# EAGLE design VibrationLights (EAGLE 8.5.0)
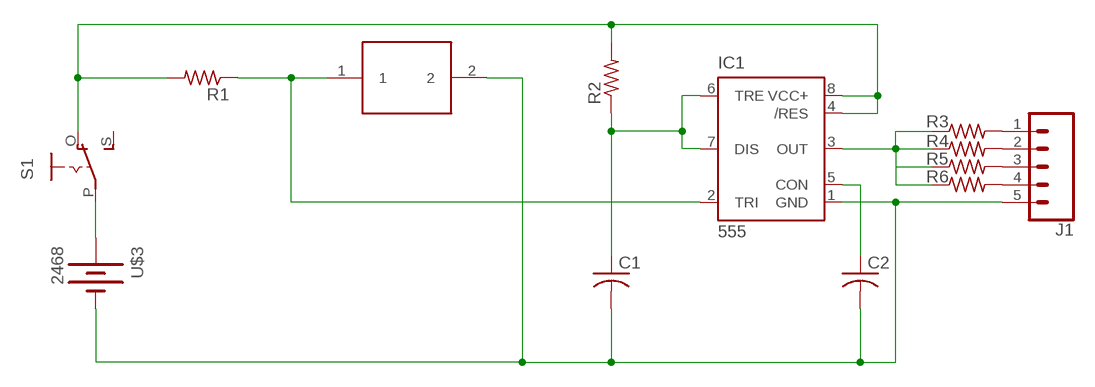
[diagram p0: schematic, sheet 1]

## Parts
C1  C-US050-045X075  [C050-045X075]
C2  C-US025-050X050  [C025-050X050]
IC1  555  555P  [DIP08]
J1  CONN_05PTH_LONGPADS  [1X05_LONGPADS]
R1  R-US_0204/5  [0204/5]
R2  R-US_0204/5  [0204/5]
R3  R-US_0204/5  [0204/5]
R4  R-US_0204/5  [0204/5]
R5  R-US_0204/5  [0204/5]
R6  R-US_0204/5  [0204/5]
S1  EG1218S  [EG1218]
U$1  SW-18010P  [SW-18010P]
U$3  2468  [2468]

## Nets
GND: C1.2 C2.2 IC1.1(GND) J1.5 U$1.2 U$3.NEG(-)
N$1: C1.1 IC1.6(TRE) IC1.7(DIS) R2.1
N$2: J1.1 R3.2
N$3: IC1.2(TRI) R1.1 U$1.1
N$4: J1.2 R4.2
N$5: C2.1 IC1.5(CON)
N$6: J1.3 R5.2
N$7: J1.4 R6.2
N$8: IC1.3(OUT) R3.1 R4.1 R5.1 R6.1
N$9: S1.P U$3.POS(+)
VCC: IC1.4(/RES) IC1.8(VCC+) R1.2 R2.2 S1.O
Unconnected: S1.S

## Library data of the parts
C1 C2 = rcl:C-US: CAPACITOR, American symbol; SPICEPREFIX: C
IC1 = SparkFun-IC-Special-Function:555: General purpose bipolar Timer Datasheet <http://www.sparkfun.com/datasheets/Components/General/ne555.pdf> SparkFun Products SparkFun SparkPunk Sequencer Kit <https://www.sparkfun.com/products/12707> (KIT-12707) Storefront Component: 555 Timer <https://www.sparkfun.com/products/9273> (COM-09273) Two parts valid for production: VFP: IC-11930 (M7555 PTH) VFP: IC-09173 (555 PTH) - Preferred; PROD_ID: IC-09173; PROD_ID_ALT: IC-09173
J1 = SparkFun-Connectors:CONN_05: Multi connection point. Often used as Generic Header-pin footprint for 0.1 inch spaced/style header connections On any of the 0.1 inch spaced packages, you can populate with these: Break Away Headers - Straight <https://www.sparkfun.com/products/116> (PRT-00116) Break Away Male Headers - Right Angle <https://www.sparkfun.com/products/553> (PRT-00553) Female Headers <https://www.sparkfun.com/products/115> (PRT-00115) Break Away Headers - Machine Pin <https://www.sparkfun.com/products/117> (PRT-00117) Break Away Female Headers - Swiss Machine Pin <https://www.sparkfun.com/products/743> (PRT-00743) For SCREWTERMINALS and SPRING TERMINALS visit here: Screw Terimnals on SparkFun.com <https://www.sparkfun.com/search/results?term=Screw+Terminals> (5mm/3.5mm/2.54mm spacing) This device is also useful as a general connection point to wire up your design to another part of your project. Our various solder wires solder well into these plated through hole pads. Hook-Up Wire - Assortment (Stranded, 22 AWG) <https://www.sparkfun.com/products/11375> (PRT-11375) Hook-Up Wire - Assortment (Solid Core, 22 AWG) <https://www.sparkfun.com/products/11367> (PRT-11367) View the entire wire category on our website here <https://www.sparkfun.com/categories/141> Special notes: Molex polarized connector foot print use with SKU : PRT-08231 with associated crimp pins and housings. 1MM SMD Version SKU: PRT-10208
R1-R6 = resistor:R-US_: RESISTOR, American symbol
S1 = adafruit:EG1218: SLIDING SWITCH 0.1" spacing through hole, vertical SPDT slide switch http://www.ladyada.net/library/pcb/eaglelibrary.html
U$1 = jgennari:SW-18010P
U$3 = jgennari:2468

## Board
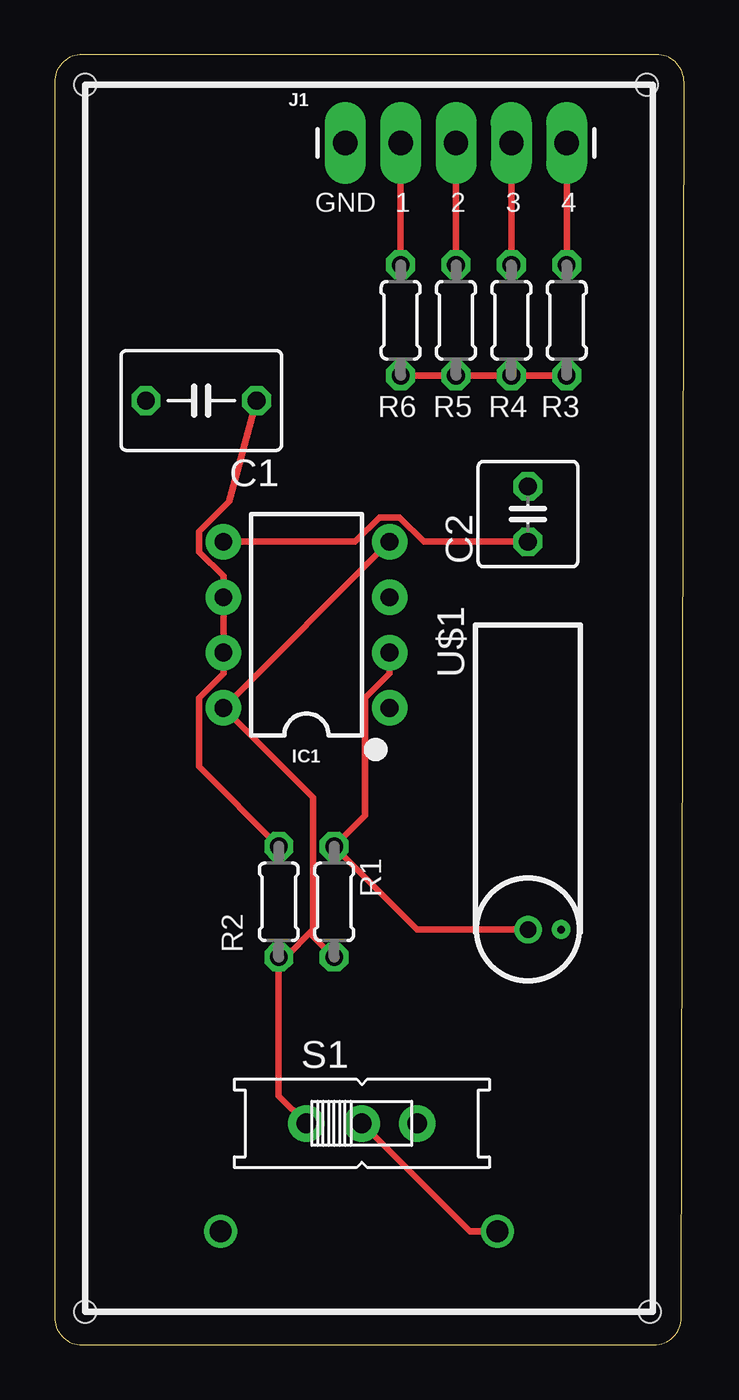
[diagram p1: board, top side]
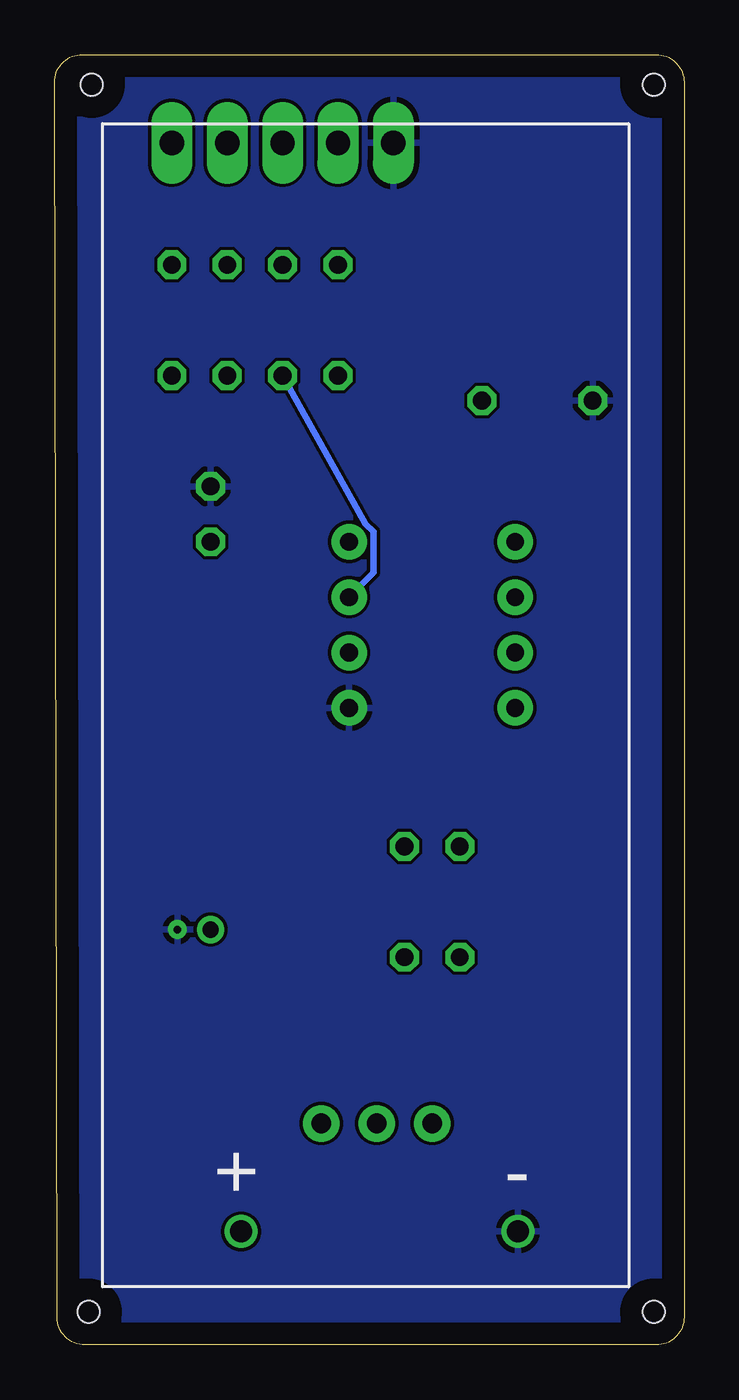
[diagram p2: board, bottom side, seen from below]

Size 28.88 x 59.17 mm. Coordinates in mm from the lower left corner, seen from the top.
Outline: 0,57.9 0,1.27 arc90 1.27,0 27.49,0 arc90 28.76,1.27 28.88,57.9 arc90 27.61,59.17 1.27,59.17 arc90 0,57.9
Copper layers (1*16): Top 0.035mm / dielectric 1.5mm / Bottom 0.035mm
Design rules "default": minimum track width 6mil, minimum drill 0.35mm, track to track 6mil, track to pad 6mil, pad to pad 6mil, via to via 6mil, smd to smd 6mil, copper to edge 40mil, drill to drill 6mil, minimum pad ring 10mil, minimum via ring 8mil, stop-mask expansion 4mil, vias tented up to drill 0mil, thermal gap 10mil
Holes 1 mm at 1.4,1.52 27.3,1.52 27.18,57.78 1.4,57.78

### Footprints (pad centres in the part's own frame; a part is rotated, then mirrored left to right if it is on the bottom)
C050-045X075 = drill 0.813 octagon: 1 -2.54,0; 2 2.54,0
C025-050X050 = drill 0.813 octagon: 1 -1.27,0; 2 1.27,0
DIP08 = drill 0.813 pad 1.626: 1 -3.81,-3.81; 2 -1.27,-3.81; 3 1.27,-3.81; 4 3.81,-3.81; 5 3.81,3.81; 6 1.27,3.81; 7 -1.27,3.81; 8 -3.81,3.81
1X05_LONGPADS = drill 1.118 pad 1.88 long: 1 0,0; 2 2.54,0; 3 5.08,0; 4 7.62,0; 5 10.16,0
0204/5 = drill 0.813 octagon: 1 -2.54,0; 2 2.54,0
EG1218 = drill 0.9 pad 1.676: O -2.54,0; P 0,0; S 2.54,0
SW-18010P = drill 0.75: 1 0,0 | drill 0.35: 2 1.524,0
2468 = drill 1: NEG 50.8,19.05; POS 50.8,6.35

### Placement (x,y rotation side)
C1  6.73,43.31 180 top
C2  21.72,38.1 90 top
IC1  11.56,33.02 90 top
J1  23.5,55.12 180 top
R1  12.83,20.32 270 top
R2  10.29,20.32 270 top
R3  23.5,46.99 90 top
R4  20.95,46.99 90 top
R5  18.41,46.99 90 top
R6  15.88,46.99 90 top
S1  14.1,10.16 0 top
U$1  21.72,19.05 0 top
U$3  26.67,56.01 270 bottom

### Tracks (layer width: path | path; a pad name or v marks a point on that pad's centre or on a via)
GND
  pour Bottom: -2.41,67.31 30.61,67.31 30.61,-2.54 -2.41,-2.54
N$1
  Top 0.305: R2.1 6.63,26.52 6.63,29.67 7.75,30.79 IC1.7 IC1.6 7.75,35.25 6.63,36.37 6.63,37.29 8,38.66 C1.1
N$2
  Top 0.305: J1.1 R3.2
N$3
  Top 0.305: U$1.1 16.64,19.05 R1.1 14.25,24.28 14.25,29.67 15.37,30.79 IC1.2
N$4
  Top 0.305: J1.2 R4.2
N$5
  Top 0.305: IC1.5 13.79,36.83 14.9,37.95 15.83,37.95 16.95,36.83 C2.1
N$6
  Top 0.305: R5.2 J1.3
N$7
  Top 0.305: R6.2 J1.4
N$8
  Top 0.305: R3.1 R4.1 R5.1 R6.1
  Bottom 0.305: R5.1 14.6,37.65 14.25,37.29 14.25,35.41 IC1.3
N$9
  Top 0.305: S1.P 19.05,5.21 U$3.POS
VCC
  Top 0.305: IC1.4 IC1.8 11.86,25.09 11.86,19.05 | 11.86,19.05 11.86,18.75 R1.2 | 11.86,19.05 10.59,17.78 R2.2 10.29,11.43 S1.O

### Text on the board
tPlace: GND | 1 | 2 | 3 | 4
tDocu: ON | OFF | VibrationLights v0.1 | J. Gennari